# EAGLE design Grove - Gas Sensor(O2) v1.0 (EAGLE 6.3)
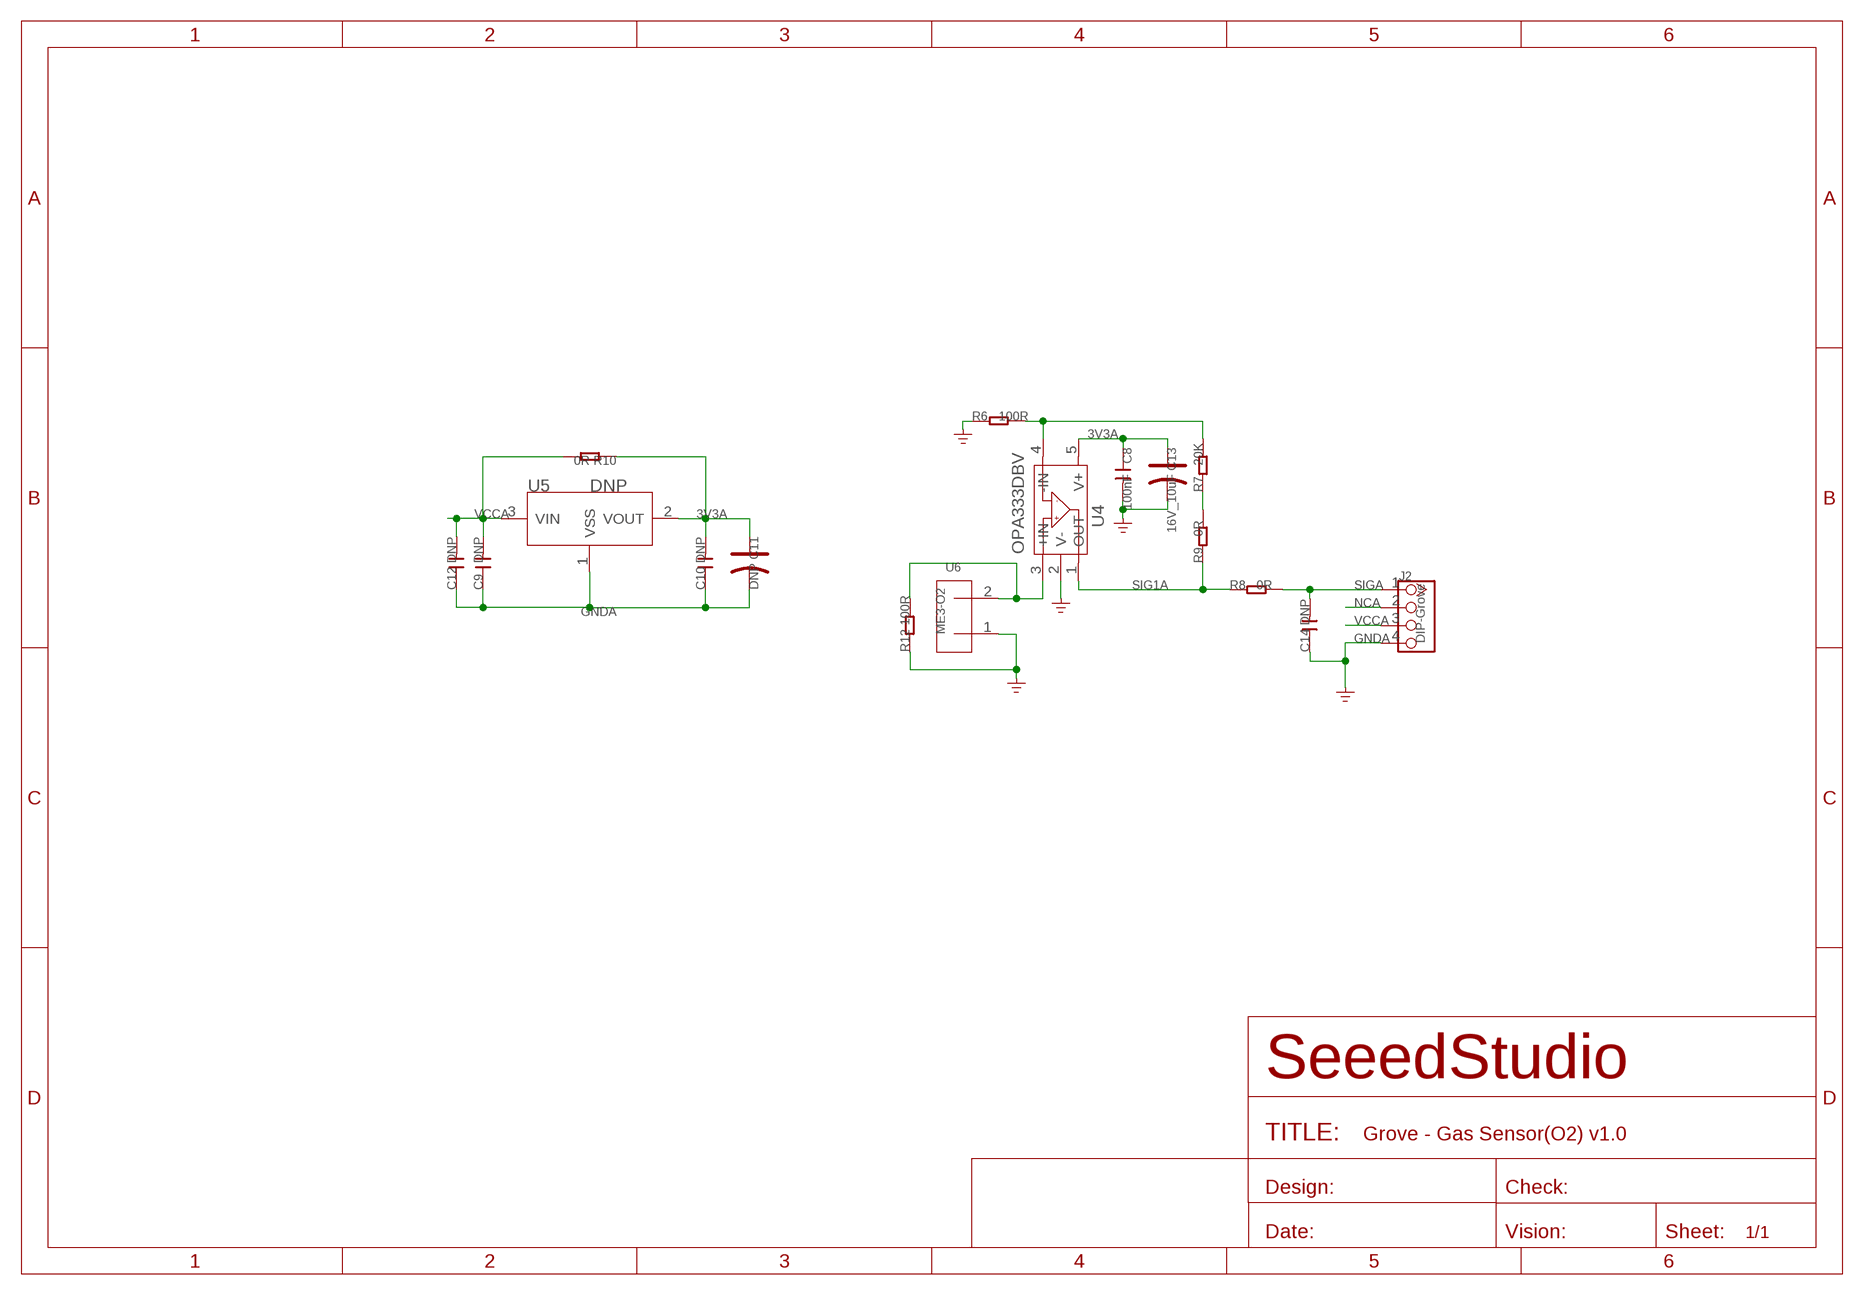
[diagram p0: schematic, sheet 1]

## Parts
C8  100nF  C-0603  [C0603]
C9  DNP  C-0603  [C0603]
C10  DNP  C-0603  [C0603]
C11  DNP  CAP-AVX-A  [AVX-A]
C12  DNP  C-0805  [C0805]
C13  16V_10uF  CAP-AVX-A  [AVX-A]
C14  DNP  C-0805  [C0805]
J2  DIP-Grove  TWIG-4P-2.0-2.0  [4P-2.0]
R6  100R  R-0603  [R0603]
R7  20K  R-0603  [R0603]
R8  0R  R-0603  [R0603]
R9  0R  R-0603  [R0603]
R10  0R  R-0603  [R0603]
R12  100R  R-0603  [R0603]
U4  OPA333DBV  [SOT23-5]
U5  DNP  XC6206MR  [SOT23]
U6  ME3-O2  [2P-D20X16H]

## Nets
3V3A: C8.1 C10.2 C11.+ C13.+ R10.1 U4.5(V+) U5.2(VOUT)
GNDA: C8.2 C9.1 C10.1 C11.- C12.1 C13.- C14.1 J2.4 R6.1 R12.1 U4.2(V-) U5.1(VSS) U6.1
N$3: R12.2 U4.3(+IN) U6.2
N$4: R6.2 R7.2 U4.4(-IN)
N$6: R7.1 R9.2
NCA: J2.2
SIG1A: R8.1 R9.1 U4.1(OUT)
SIGA: C14.2 J2.1 R8.2
VCCA: C9.2 C12.2 J2.3 R10.2 U5.3(VIN)

## Library data of the parts
C8-C10 C12 C14 = Discrete:C*: Ceramic Capacitors
C11 C13 = Discrete:CAP*: Electrolytic Capacitors,Tantalum Capacitors and Super Capacitors
J2 = Connector:TWIG-4P-2.0
R6-R10 R12 = Discrete:R*
U4 = IC:OPA333: 1.8V,Micro power CMOS oprational amplifiers Zero-Drift Series http://www.ti.com.cn/cn/lit/ds/symlink/opa333.pdf
U5 = IC:XC6206: LOW ESR Cap.Compatible Positive Voltage Regulators
U6 = template:ME3-O2

## Board
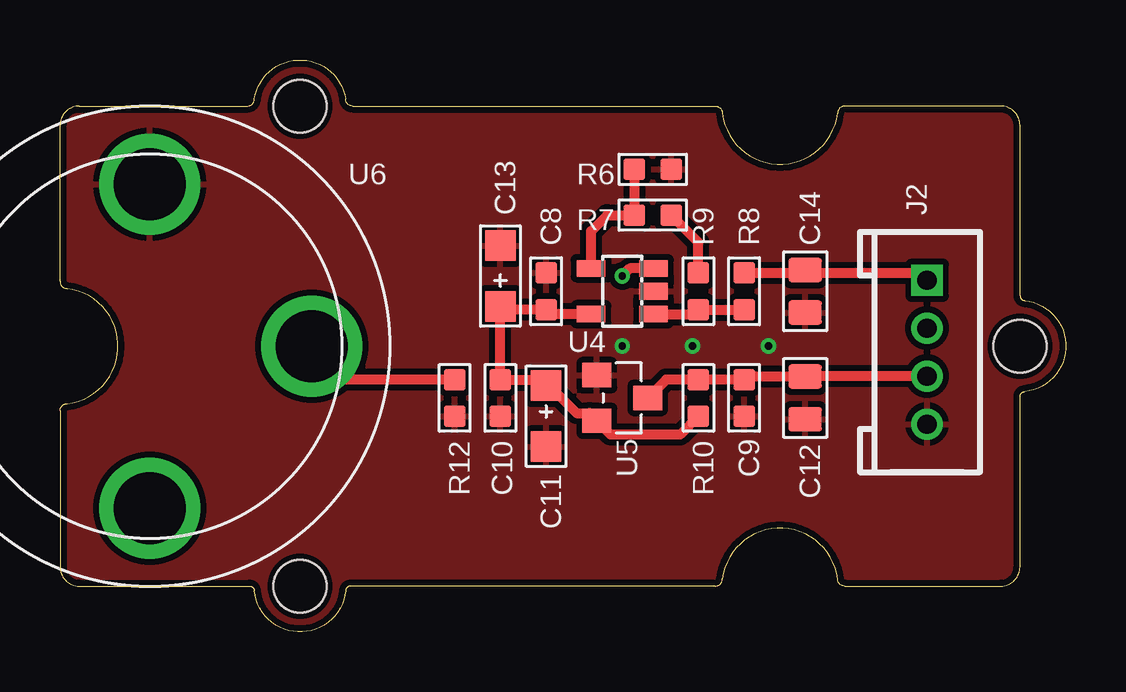
[diagram p1: board, top side]
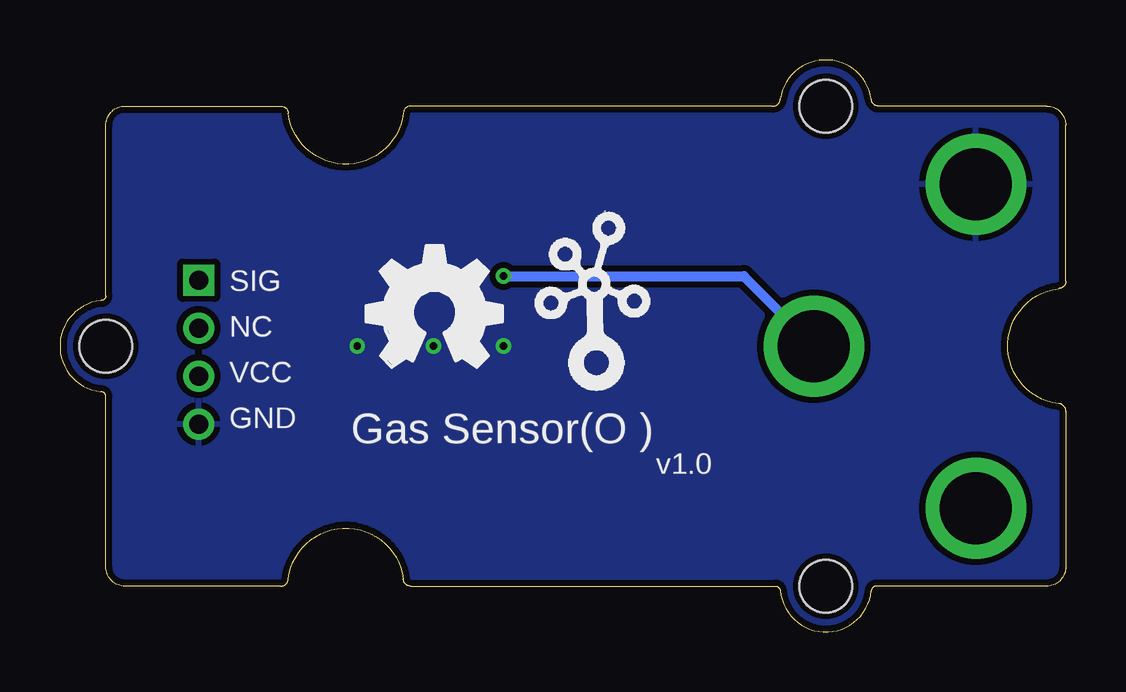
[diagram p2: board, bottom side, seen from below]

Size 41.91 x 23.83 mm. Coordinates in mm from the lower left corner, seen from the top.
Copper layers (1*16): Top 0.035mm / dielectric 1.5mm / Bottom 0.035mm
Design rules "SeeedStudio_rule_no_angle_090911 *": minimum track width 6mil, minimum drill 12mil, track to track 6mil, track to pad 6mil, pad to pad 6mil, via to via 6mil, smd to smd 0mil, copper to edge 10mil, drill to drill 10mil, minimum pad ring 10mil, minimum via ring 6mil, stop-mask expansion 2mil, vias tented up to drill 25mil, thermal gap 10mil

### Footprints (pad centres in the part's own frame; a part is rotated, then mirrored left to right if it is on the bottom)
C0603 = smd 0.889 x 0.889: 1 -0.762,0; 2 0.762,0
AVX-A = smd 1.27 x 1.27: + -1.27,0; - 1.27,0
C0805 = smd 1.016 x 1.397: 1 -0.889,0; 2 0.889,0
4P-2.0 = drill 0.8 pad 1.27 square: 1 -3,0 | drill 0.8 pad 1.27: 2 -1,0; 3 1,0; 4 3,0
R0603 = smd 0.889 x 0.889: 1 -0.762,0; 2 0.762,0
SOT23-5 = smd 0.69 x 1.2: 1 -0.95,-1.3; 2 0,-1.3; 3 0.95,-1.3; 4 0.95,1.3; 5 -0.95,1.3
SOT23 = smd 1.016 x 1.2: 1 -0.95,-1.06; 2 0.95,-1.06; 3 0,1.06
2P-D20X16H = drill 3 pad 4.2: 1 6.75,0; 2 0,-6.75; 3 -6.75,0
2U-DIM-W/DRILL = hole 2.2: -10,-10; -10,10; 20,0

### Placement (x,y rotation side)
C8  20.25,14.19 90 top
C9  28.51,9.75 90 top
C10  18.35,9.75 90 top
C11  20.25,8.99 270 top
C12  31.05,9.75 90 top
C13  18.35,14.83 90 top
C14  31.05,14.19 90 top
J2  36.13,11.65 270 top
R6  24.7,19.27 180 top
R7  24.7,17.37 180 top
R8  28.51,14.19 90 top
R9  26.6,14.19 90 top
R10  26.6,9.75 90 top
R12  16.44,9.75 90 top
U4  23.43,14.19 90 top
U5  23.43,9.75 270 top
U6  3.74,11.91 90 top
U$1  [2U-DIM-W/DRILL]  20,11.91 0 top
U$15  [OSHW_FILLX200_NOTEXT]  29.14,11.02 0 bottom
U$17  [TWIGLOGO]  19.62,11.02 0 bottom

### Tracks (layer width: path | path; a pad name or v marks a point on that pad's centre or on a via)
3V3A
  Top 0.406: U4.5 20.44,13.24 C8.1 18.48,13.43 C13.+ C10.2 20,10.51 C11.+ 20.38,10.26 21.52,9.11 22.05,9.11 U5.2 22.94,8.23 25.84,8.23 R10.1
GNDA  (via drill 0.3 pad 0.64)
  other vias: 23.43,11.91 26.35,11.91 29.52,11.91
  pour Top (isolate 0.254, rank 2): -0.07,0.22 41.84,0.22 41.84,22.45 41.84,24.35 -0.07,24.35 -0.07,0.35
  pour Bottom (isolate 0.254, rank 2): -0.07,0.22 41.84,0.22 41.84,22.45 41.84,24.35 -0.07,24.35 -0.07,0.35
N$3  (via drill 0.3 pad 0.64)
  Top 0.406: U4.3 23.74,15.14 v23.43,14.83 | R12.2 11.89,10.51 U6.2
  Bottom 0.406: v23.43,14.83 13.41,14.83 U6.2
N$4
  Top 0.406: U4.4 22.13,16.7 22.79,17.37 R7.2 R6.2
N$6
  Top 0.406: R9.2 26.6,16.23 R7.1
SIG1A
  Top 0.406: U4.1 26.42,13.24 R9.1 R8.1
SIGA
  Top 0.406: C14.2 30.92,14.96 R8.2 35.83,14.96 J2.1
VCCA
  Top 0.406: J2.3 31.06,10.65 C12.2 28.64,10.64 | C9.2 R10.2 25.25,10.51 U5.3
  Top 0.61: 28.64,10.64 C9.2

### Text on the board
bPlace: SIG | NC | VCC | Gas Sensor(O ) | GND | v1.0